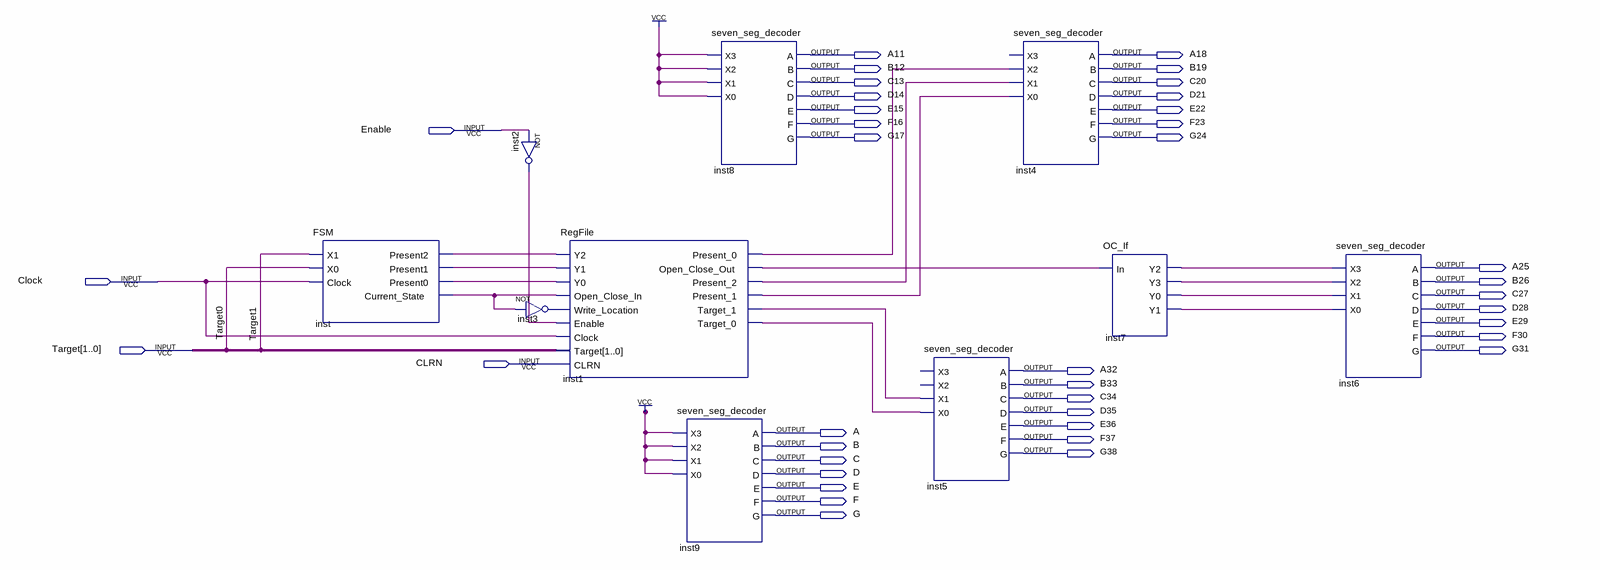
[diagram p0: schematic sheet]
// Quartus schematic Toplevel.bdf as structural Verilog: 10 symbols, 39 pins
module Toplevel (
  input  Enable,
  input  Clock,
  input  [1:0] Target,
  input  CLRN,
  output A11,
  output A18,
  output B12,
  output B19,
  output C13,
  output C20,
  output D14,
  output D21,
  output E15,
  output E22,
  output F16,
  output F23,
  output G17,
  output G24,
  output A25,
  output B26,
  output C27,
  output D28,
  output E29,
  output F30,
  output G31,
  output A32,
  output B33,
  output C34,
  output D35,
  output E36,
  output A,
  output F37,
  output B,
  output G38,
  output C,
  output D,
  output E,
  output F,
  output G
);

  wire inst1_open_close_out, inst1_present_0, inst1_present_1, inst1_present_2, inst1_target_0,
       inst1_target_1, inst2_out, inst3_out, inst7_y0, inst7_y1, inst7_y2, inst7_y3, inst_current_state,
       inst_present0, inst_present1, inst_present2;

  FSM inst (
    .X1(Target[1]), .X0(Target[0]), .Clock(Clock), .Present2(inst_present2), .Present1(inst_present1),
    .Present0(inst_present0), .Current_State(inst_current_state));
  not inst2 (inst2_out, Enable);
  not inst3 (inst3_out, inst_current_state);
  RegFile inst1 (
    .Y2(inst_present2), .Y1(inst_present1), .Y0(inst_present0), .Open_Close_In(inst_current_state),
    .Write_Location(inst3_out), .Enable(inst2_out), .Clock(Clock), .Target(Target), .CLRN(CLRN),
    .Present_0(inst1_present_0), .Open_Close_Out(inst1_open_close_out), .Present_2(inst1_present_2),
    .Present_1(inst1_present_1), .Target_1(inst1_target_1), .Target_0(inst1_target_0));
  seven_seg_decoder inst9 (.X3(1'b1), .X2(1'b1), .X1(1'b1), .X0(1'b1), .A(A), .B(B), .C(C), .D(D), .E(E), .F(F), .G(G));
  seven_seg_decoder inst8 (
    .X3(1'b1), .X2(1'b1), .X1(1'b1), .X0(1'b1), .A(A11), .B(B12), .C(C13), .D(D14), .E(E15), .F(F16), .G(G17));
  seven_seg_decoder inst5 (
    .X1(inst1_target_1), .X0(inst1_target_0), .A(A32), .B(B33), .C(C34), .D(D35), .E(E36), .F(F37), .G(G38));  // open: X3, X2
  seven_seg_decoder inst4 (
    .X2(inst1_present_0), .X1(inst1_present_2), .X0(inst1_present_1), .A(A18), .B(B19), .C(C20), .D(D21),
    .E(E22), .F(F23), .G(G24));  // open: X3
  OC_If inst7 (.In(inst1_open_close_out), .Y2(inst7_y2), .Y3(inst7_y3), .Y0(inst7_y0), .Y1(inst7_y1));
  seven_seg_decoder inst6 (
    .X3(inst7_y2), .X2(inst7_y3), .X1(inst7_y0), .X0(inst7_y1), .A(A25), .B(B26), .C(C27), .D(D28), .E(E29),
    .F(F30), .G(G31));
endmodule
